# Altium project 070323 Terminal Board R3.PrjPcb
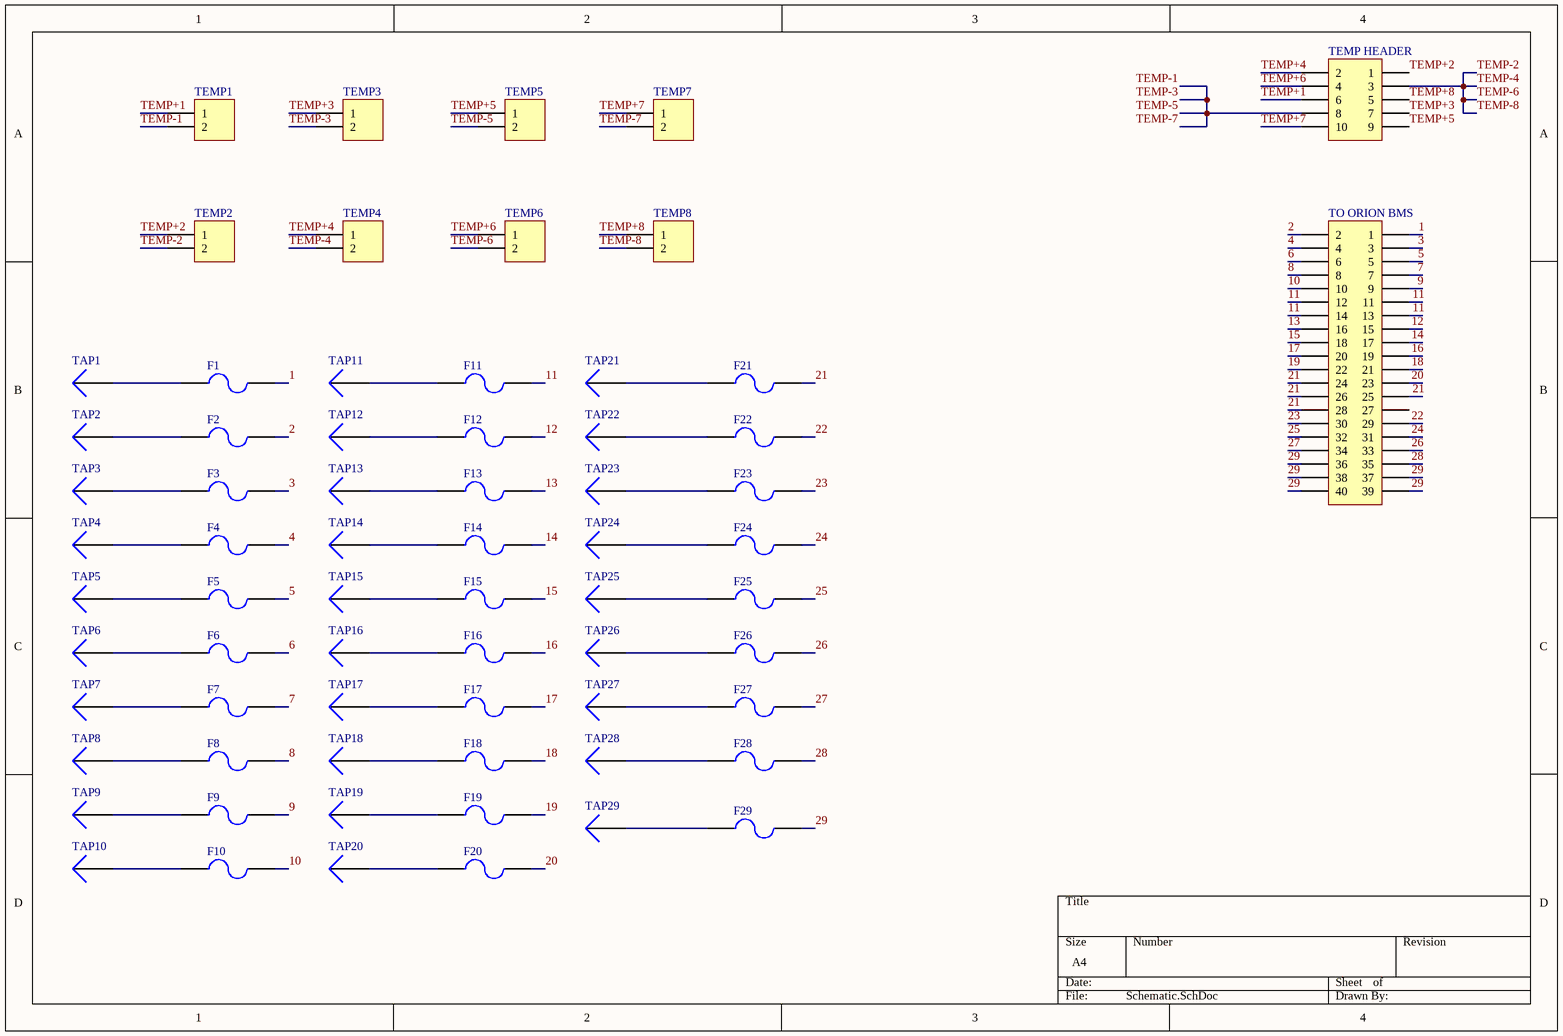
[diagram p0: Schematic.SchDoc]
1 sheet, 68 parts. Net scope: global (net labels, ports and power ports of the same name join across sheets).
Board file: PCB.PcbDoc

## Sheet Schematic.SchDoc
size A4

### Parts
F1  (no value)  [0451Series_LTF]
F2  (no value)  [0451Series_LTF]
F3  (no value)  [0451Series_LTF]
F4  (no value)  [0451Series_LTF]
F5  (no value)  [0451Series_LTF]
F6  (no value)  [0451Series_LTF]
F7  (no value)  [0451Series_LTF]
F8  (no value)  [0451Series_LTF]
F9  (no value)  [0451Series_LTF]
F10  (no value)  [0451Series_LTF]
F11  (no value)  [0451Series_LTF]
F12  (no value)  [0451Series_LTF]
F13  (no value)  [0451Series_LTF]
F14  (no value)  [0451Series_LTF]
F15  (no value)  [0451Series_LTF]
F16  (no value)  [0451Series_LTF]
F17  (no value)  [0451Series_LTF]
F18  (no value)  [0451Series_LTF]
F19  (no value)  [0451Series_LTF]
F20  (no value)  [0451Series_LTF]
F21  (no value)  [0451Series_LTF]
F22  (no value)  [0451Series_LTF]
F23  (no value)  [0451Series_LTF]
F24  (no value)  [0451Series_LTF]
F25  (no value)  [0451Series_LTF]
F26  (no value)  [0451Series_LTF]
F27  (no value)  [0451Series_LTF]
F28  (no value)  [0451Series_LTF]
F29  (no value)  [0451Series_LTF]
TAP1  (no value)  [S7051-42R]
TAP2  (no value)  [S7051-42R]
TAP3  (no value)  [S7051-42R]
TAP4  (no value)  [S7051-42R]
TAP5  (no value)  [S7051-42R]
TAP6  (no value)  [S7051-42R]
TAP7  (no value)  [S7051-42R]
TAP8  (no value)  [S7051-42R]
TAP9  (no value)  [S7051-42R]
TAP10  (no value)  [S7051-42R]
TAP11  (no value)  [S7051-42R]
TAP12  (no value)  [S7051-42R]
TAP13  (no value)  [S7051-42R]
TAP14  (no value)  [S7051-42R]
TAP15  (no value)  [S7051-42R]
TAP16  (no value)  [S7051-42R]
TAP17  (no value)  [S7051-42R]
TAP18  (no value)  [S7051-42R]
TAP19  (no value)  [S7051-42R]
TAP20  (no value)  [S7051-42R]
TAP21  (no value)  [S7051-42R]
TAP22  (no value)  [S7051-42R]
TAP23  (no value)  [S7051-42R]
TAP24  (no value)  [S7051-42R]
TAP25  (no value)  [S7051-42R]
TAP26  (no value)  [S7051-42R]
TAP27  (no value)  [S7051-42R]
TAP28  (no value)  [S7051-42R]
TAP29  (no value)  [S7051-42R]
TEMP1  (no value)  [S2B-XH-A(LF)(SN)]
TEMP2  (no value)  [S2B-XH-A(LF)(SN)]
TEMP3  (no value)  [S2B-XH-A(LF)(SN)]
TEMP4  (no value)  [S2B-XH-A(LF)(SN)]
TEMP5  (no value)  [S2B-XH-A(LF)(SN)]
TEMP6  (no value)  [S2B-XH-A(LF)(SN)]
TEMP7  (no value)  [S2B-XH-A(LF)(SN)]
TEMP8  (no value)  [S2B-XH-A(LF)(SN)]
TEMP_HEADER  (no value)  [39288100]
TO_ORION_BMS  (no value)  [1376113-6]

### Nets
1: F1.2 TO_ORION_BMS.1
2: F2.2 TO_ORION_BMS.2
3: F3.2 TO_ORION_BMS.3
4: F4.2 TO_ORION_BMS.4
5: F5.2 TO_ORION_BMS.5
6: F6.2 TO_ORION_BMS.6
7: F7.2 TO_ORION_BMS.7
8: F8.2 TO_ORION_BMS.8
9: F9.2 TO_ORION_BMS.9
10: F10.2 TO_ORION_BMS.10
11: F11.2 TO_ORION_BMS.11 TO_ORION_BMS.12 TO_ORION_BMS.13 TO_ORION_BMS.14
12: F12.2 TO_ORION_BMS.15
13: F13.2 TO_ORION_BMS.16
14: F14.2 TO_ORION_BMS.17
15: F15.2 TO_ORION_BMS.18
16: F16.2 TO_ORION_BMS.19
17: F17.2 TO_ORION_BMS.20
18: F18.2 TO_ORION_BMS.21
19: F19.2 TO_ORION_BMS.22
20: F20.2 TO_ORION_BMS.23
21: F21.2 TO_ORION_BMS.24 TO_ORION_BMS.25 TO_ORION_BMS.26 TO_ORION_BMS.28
22: F22.2 TO_ORION_BMS.29
23: F23.2 TO_ORION_BMS.30
24: F24.2 TO_ORION_BMS.31
25: F25.2 TO_ORION_BMS.32
26: F26.2 TO_ORION_BMS.33
27: F27.2 TO_ORION_BMS.34
28: F28.2 TO_ORION_BMS.35
29: F29.2 TO_ORION_BMS.36 TO_ORION_BMS.37 TO_ORION_BMS.38 TO_ORION_BMS.39 TO_ORION_BMS.40
TEMP+1: TEMP1.1 TEMP_HEADER.6
TEMP+2: TEMP2.1 TEMP_HEADER.1
TEMP+3: TEMP3.1 TEMP_HEADER.7
TEMP+4: TEMP4.1 TEMP_HEADER.2
TEMP+5: TEMP5.1 TEMP_HEADER.9
TEMP+6: TEMP6.1 TEMP_HEADER.4
TEMP+7: TEMP7.1 TEMP_HEADER.10
TEMP+8: TEMP8.1 TEMP_HEADER.5
TEMP-1: TEMP1.2 TEMP3.2 TEMP5.2 TEMP7.2 TEMP_HEADER.8  [also labelled TEMP-3, TEMP-5, TEMP-7]
TEMP-2: TEMP2.2 TEMP4.2 TEMP6.2 TEMP8.2 TEMP_HEADER.3  [also labelled TEMP-4, TEMP-6, TEMP-8]
NetF1_1: F1.1 TAP1.1(="part_number")
NetF2_1: F2.1 TAP2.1(="part_number")
NetF3_1: F3.1 TAP3.1(="part_number")
NetF4_1: F4.1 TAP4.1(="part_number")
NetF5_1: F5.1 TAP5.1(="part_number")
NetF6_1: F6.1 TAP6.1(="part_number")
NetF7_1: F7.1 TAP7.1(="part_number")
NetF8_1: F8.1 TAP8.1(="part_number")
NetF9_1: F9.1 TAP9.1(="part_number")
NetF10_1: F10.1 TAP10.1(="part_number")
NetF11_1: F11.1 TAP11.1(="part_number")
NetF12_1: F12.1 TAP12.1(="part_number")
NetF13_1: F13.1 TAP13.1(="part_number")
NetF14_1: F14.1 TAP14.1(="part_number")
NetF15_1: F15.1 TAP15.1(="part_number")
NetF16_1: F16.1 TAP16.1(="part_number")
NetF17_1: F17.1 TAP17.1(="part_number")
NetF18_1: F18.1 TAP18.1(="part_number")
NetF19_1: F19.1 TAP19.1(="part_number")
NetF20_1: F20.1 TAP20.1(="part_number")
NetF21_1: F21.1 TAP21.1(="part_number")
NetF22_1: F22.1 TAP22.1(="part_number")
NetF23_1: F23.1 TAP23.1(="part_number")
NetF24_1: F24.1 TAP24.1(="part_number")
NetF25_1: F25.1 TAP25.1(="part_number")
NetF26_1: F26.1 TAP26.1(="part_number")
NetF27_1: F27.1 TAP27.1(="part_number")
NetF28_1: F28.1 TAP28.1(="part_number")
NetF29_1: F29.1 TAP29.1(="part_number")

Not connected (* = marked no-connect by the designer): TO_ORION_BMS 27

### Library data of the parts
F1-F29 = 0154.750MRL: FUSE BOARD MNT 750MA 125VAC/VDC; Manufacturer: Littelfuse Inc.; Part Number: 0154.750MRL; Digikey Part Number: F2576CT-ND; Digikey Link: https://www.digikey.com.au/en/products/detail/littelfuse-inc/0451-750MRL/700816
TAP1-TAP29 = S7051-42R: Positions: 1; Pitch: NA; Angle: 90; Contact: Gold; Part Number: S7051-42R; Row Spacing: NA; Flange: NA; Digikey Part Number: 952-1741-1-ND; Digikey Link: https://www.digikey.com.au/en/products/detail/harwin-inc/S7051-42R/3131057
TEMP1-TEMP8 = S2B-XH-A(LF)(SN): Positions: 2; Pitch: 2.54mm; Angle: 0; Flange: No; Contact: NA; Part Number: S2B-XH-A(LF)(SN); Row Spacing: 2.54mm; Digikey Part Number: 455-2257-ND; Digikey Link: https://www.digikey.com.au/en/products/detail/jst-sales-america-inc/S2B-XH-A-LF-SN/1651055
TEMP_HEADER = 39288100: Pitch: 4.2mm; Row Spacing: 5.5mm; Angle: 0; Flange: No; Contact: Tin; Part Number: 39288100; Positions: 10; Digikey Part Number: WM23804-ND
TO_ORION_BMS = 1376113-6: Positions: 40; Pitch: 3; Row Spacing: 2.2; Angle: 180; Flange: na; Contact: Gold; Part Number: 1376113-6; Digikey Part Number: 1376113-6-ND; Digikey Link: https://www.digikey.com.au/products/en?keywords=1376113-6